# EasyEDA schematic SCH_ACSI2STM_EasyEDA.json
TITLE: ACSI2STM Full featured; REV: 1.0; Date: 2022-05-09; Sheet: 1/1; Drawn By: jmclabexperience
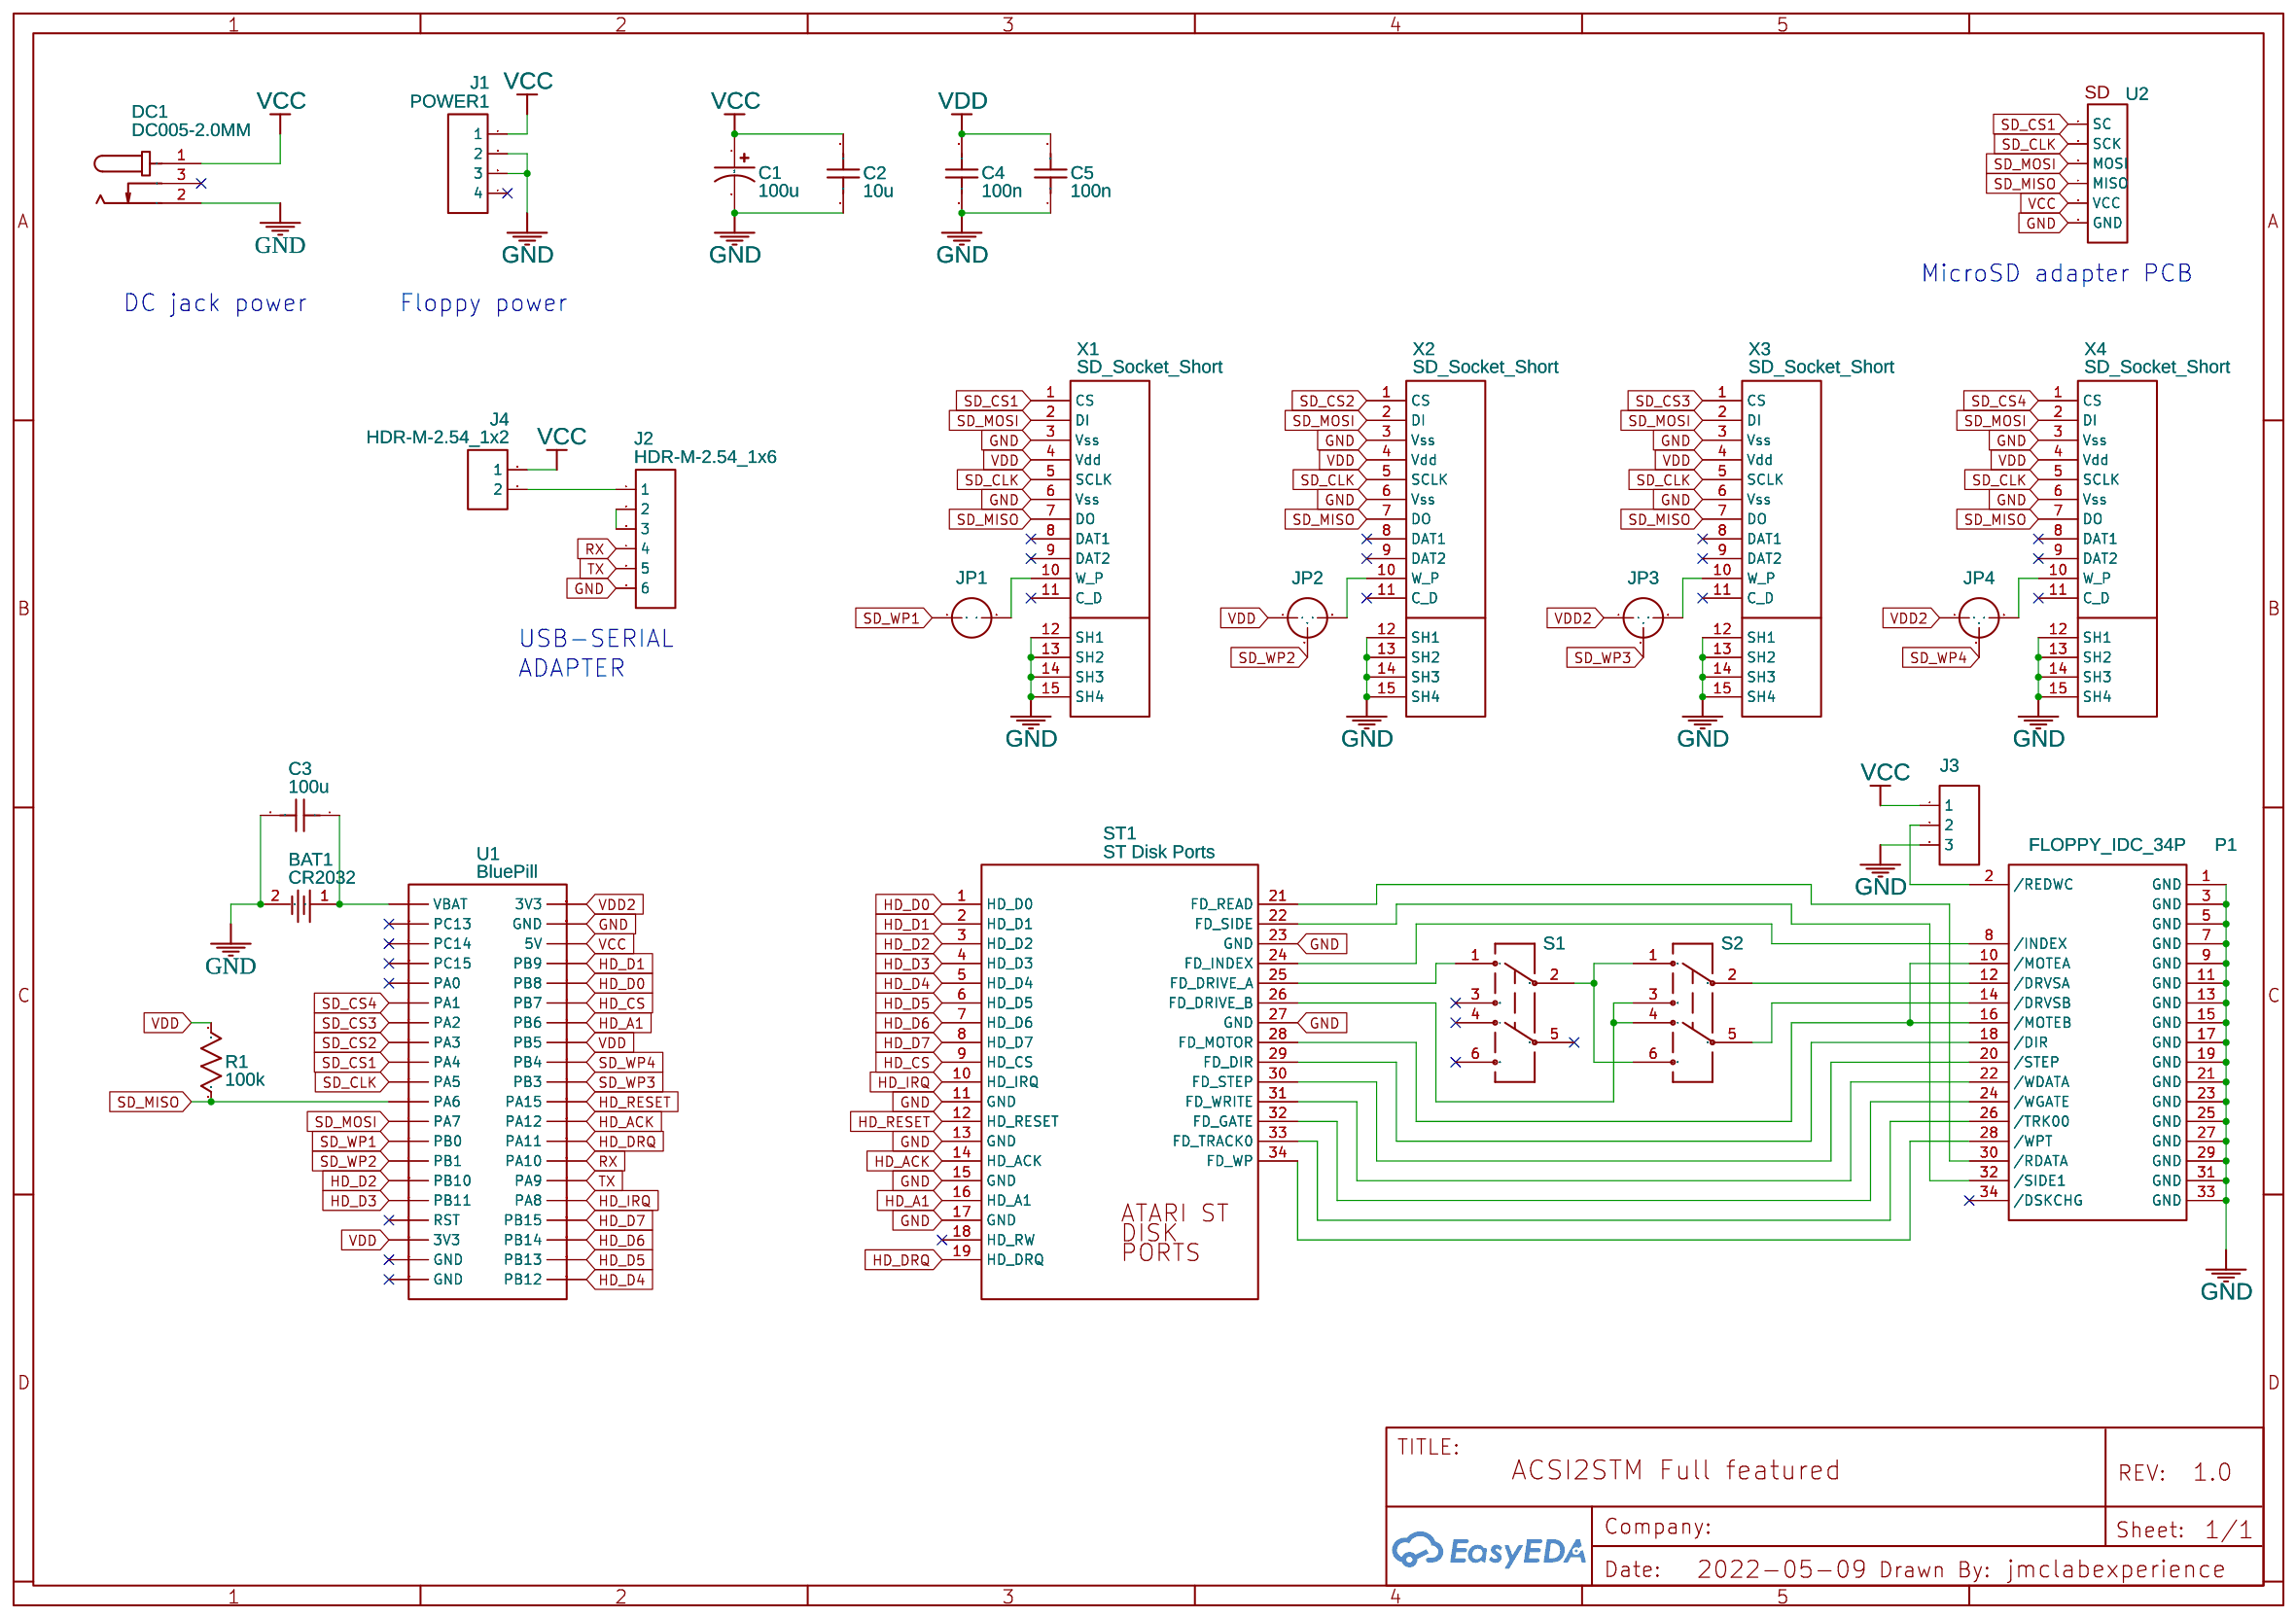
[diagram p0: schematic sheet]

## Parts
BAT1  CR2032  [BAT-TH_CR2032-1]
C1  100u  [CAP-D6.3×F2.5]
C2  10u  [C1206]
C3  100u  [C1206]
C4  100n  [C0805]
C5  100n  [C0805]
DC1  DC005-2.0MM  [DC-IN-TH_DC005-T20]
J1  POWER1  [HDR-M-2.54_1X4]
J2  HDR-M-2.54_1x6  [HDR-M-2.54_1X6]
J3  HDR-M-2.54_1x3  [HDR-M-2.54_1X3]
J4  HDR-M-2.54_1x2  [HDR-M-2.54_1X2]
JP1  Solder jumper 2P  [SOLDER_JMP_2]
JP2  Solder jumper 3P  [SOLDER_JMP_3]
JP3  Solder jumper 3P  [SOLDER_JMP_3]
JP4  Solder jumper 3P  [SOLDER_JMP_3]
P1  FLOPPY_IDC_34P  [Z-231011034106]
R1  100k  [R0805]
S1  SWITCH-DPDT  [SWITCH_DPDT_TOGGLE]
S2  SWITCH-DPDT  [SWITCH_DPDT_TOGGLE]
ST1  ST Disk Ports  [ST_DISK]
U1  BluePill  [BLUEPILL]
U2  SD1  [SDV2]
X1  SD_Socket_Short  [SD_SHORT]
X2  SD_Socket_Short  [SD_SHORT]
X3  SD_Socket_Short  [SD_SHORT]
X4  SD_Socket_Short  [SD_SHORT]

## Library data of the parts
BAT1 = CR2032_C9900007674: Supplier: LCSC; Supplier Part: C9900007674; Manufacturer: null; link: https://atta.szlcsc.comnull; JLCPCB Part Class: Extended Part; Contributor: lcsc
C1 = CE_TH_D6.3×F2.5_US: Contributor: LCEDA_Lib
C2 C3 = C_1206_US: Contributor: LCEDA_Lib
C4 C5 = C_0805_US: Contributor: LCEDA_Lib
DC1 = DC005-2.0MM: Supplier: LCSC; Manufacturer: SOFNG; Supplier Part: C111567; JLCPCB Part Class: Extended Part
J1 = HDR-M-2.54_1x4: Supplier Part: C124378; Supplier: LCSC; Contributor: LCEDA_Lib
J2 = HDR-M-2.54_1x6: Supplier Part: C190819; Supplier: LCSC; Contributor: LCEDA_Lib
J3 = HDR-M-2.54_1x3: Supplier Part: C180248; Supplier: LCSC; Contributor: LCEDA_Lib
J4 = HDR-M-2.54_1x2: Supplier Part: C124375; Supplier: LCSC; Contributor: LCEDA_Lib
JP1 = Solder jumper 2P: Contributor: jmclabexperience
JP2-JP4 = Solder jumper 3P: Contributor: jmclabexperience
P1 = FLOPPY_IDC_34P: Supplier Part: c221055; Supplier: LCSC; Manufacturer: Nextronics; Contributor: HansN
R1 = R_0805_US: Contributor: LCEDA_Lib
S1 S2 = SWITCH-DPDT: DPDT Version of the COM-00597; Contributor: jmclabexperience
ST1 = ST Disk Ports: Contributor: jmclabexperience
U1 = BluePill: Contributor: alexander.gavrilenko
U2 = SD: Contributor: Media Work
X1-X4 = SD_Socket_Short: Contributor: Roman Boykov

## Nets
GND: BAT1.2 C1.2 C2.1 C3.2 C4.1 C5.1 DC1.2 J1.2 J1.3 J2.6 J3.3 P1.1(GND) P1.3(GND) P1.5(GND) P1.7(GND) P1.9(GND) P1.11(GND) P1.13(GND) P1.15(GND) P1.17(GND) P1.19(GND) P1.21(GND) P1.23(GND) P1.25(GND) P1.27(GND) P1.29(GND) P1.31(GND) P1.33(GND) ST1.11(GND) ST1.13(GND) ST1.15(GND) ST1.17(GND) ST1.23(GND) ST1.27(GND) U1.GND_3(GND) U2.6(GND) X1.3(Vss) X1.6(Vss) X1.12(SH1) X1.13(SH2) X1.14(SH3) X1.15(SH4) X2.3(Vss) X2.6(Vss) X2.12(SH1) X2.13(SH2) X2.14(SH3) X2.15(SH4) X3.3(Vss) X3.6(Vss) X3.12(SH1) X3.13(SH2) X3.14(SH3) X3.15(SH4) X4.3(Vss) X4.6(Vss) X4.12(SH1) X4.13(SH2) X4.14(SH3) X4.15(SH4)
VCC: C1.1 C2.2 DC1.1 J1.1 J3.1 J4.1 U1.5V U2.5(VCC)
VDD: C4.2 C5.2 JP2.1 R1.2 U1.3V3_1(3V3) U1.PB5 X1.4(Vdd) X2.4(Vdd) X3.4(Vdd) X4.4(Vdd)
VDD2: JP3.1 JP4.1 U1.3V3_2(3V3)
HD_A1: ST1.16(HD_A1) U1.PB6
HD_ACK: ST1.14(HD_ACK) U1.PA12
HD_CS: ST1.9(HD_CS) U1.PB7
HD_D0: ST1.1(HD_D0) U1.PB8
HD_D1: ST1.2(HD_D1) U1.PB9
HD_D2: ST1.3(HD_D2) U1.PB10
HD_D3: ST1.4(HD_D3) U1.PB11
HD_D4: ST1.5(HD_D4) U1.PB12
HD_D5: ST1.6(HD_D5) U1.PB13
HD_D6: ST1.7(HD_D6) U1.PB14
HD_D7: ST1.8(HD_D7) U1.PB15
HD_DRQ: ST1.19(HD_DRQ) U1.PA11
HD_IRQ: ST1.10(HD_IRQ) U1.PA8
HD_RESET: ST1.12(HD_RESET) U1.PA15
RX: J2.4 U1.PA10
SD_CLK: U1.PA5 U2.2(SCK) X1.5(SCLK) X2.5(SCLK) X3.5(SCLK) X4.5(SCLK)
SD_CS1: U1.PA4 U2.1(SC) X1.1(CS)
SD_CS2: U1.PA3 X2.1(CS)
SD_CS3: U1.PA2 X3.1(CS)
SD_CS4: U1.PA1 X4.1(CS)
SD_MISO: R1.1 U1.PA6 U2.4(MISO) X1.7(DO) X2.7(DO) X3.7(DO) X4.7(DO)
SD_MOSI: U1.PA7 U2.3(MOSI) X1.2(DI) X2.2(DI) X3.2(DI) X4.2(DI)
SD_WP1: JP1.1 U1.PB0
SD_WP2: JP2.2 U1.PB1
SD_WP3: JP3.2 U1.PB3
SD_WP4: JP4.2 U1.PB4
TX: J2.5 U1.PA9
Net-(BAT1-1): BAT1.1 C3.1 U1.VBAT
Net-(J2-1): J2.1 J4.2
Net-(J2-2): J2.2 J2.3
Net-(J3-2): J3.2 P1.2(/REDWC)
Net-(JP1-2): JP1.2 X1.10(W_P)
Net-(JP2-3): JP2.3 X2.10(W_P)
Net-(JP3-3): JP3.3 X3.10(W_P)
Net-(JP4-3): JP4.3 X4.10(W_P)
Net-(P1-8): P1.8(/INDEX) ST1.24(FD_INDEX)
Net-(P1-10): P1.10(/MOTEA) P1.16(/MOTEB) ST1.28(FD_MOTOR)
Net-(P1-12): P1.12(/DRVSA) S2.2
Net-(P1-14): P1.14(/DRVSB) S2.5
Net-(P1-18): P1.18(/DIR) ST1.29(FD_DIR)
Net-(P1-20): P1.20(/STEP) ST1.30(FD_STEP)
Net-(P1-22): P1.22(/WDATA) ST1.31(FD_WRITE)
Net-(P1-24): P1.24(/WGATE) ST1.32(FD_GATE)
Net-(P1-26): P1.26(/TRK00) ST1.33(FD_TRACK0)
Net-(P1-28): P1.28(/WPT) ST1.34(FD_WP)
Net-(P1-30): P1.30(/RDATA) ST1.21(FD_READ)
Net-(P1-32): P1.32(/SIDE1) ST1.22(FD_SIDE)
Net-(S1-1): S1.1 ST1.25(FD_DRIVE_A)
Net-(S1-2): S1.2 S2.1 S2.6
Net-(S2-3): S2.3 S2.4 ST1.26(FD_DRIVE_B)

Not connected (* = marked no-connect by the designer): DC1 3*; J1 4*; P1 34(/DSKCHG)*; S1 3* 4* 5* 6*; ST1 18(HD_RW)*; U1 GND_1(GND)* GND_2(GND)* PA0* PC13* PC14* PC15* RST*; X1 8(DAT1)* 9(DAT2)* 11(C_D)*; X2 8(DAT1)* 9(DAT2)* 11(C_D)*; X3 8(DAT1)* 9(DAT2)* 11(C_D)*; X4 8(DAT1)* 9(DAT2)* 11(C_D)*

## Notes on the sheet
- MicroSD adapter PCB
- DC jack power
- Floppy power
- USB-SERIAL
- ADAPTER
